# Altium schematic sheet Sheet1.SchDoc
size A4
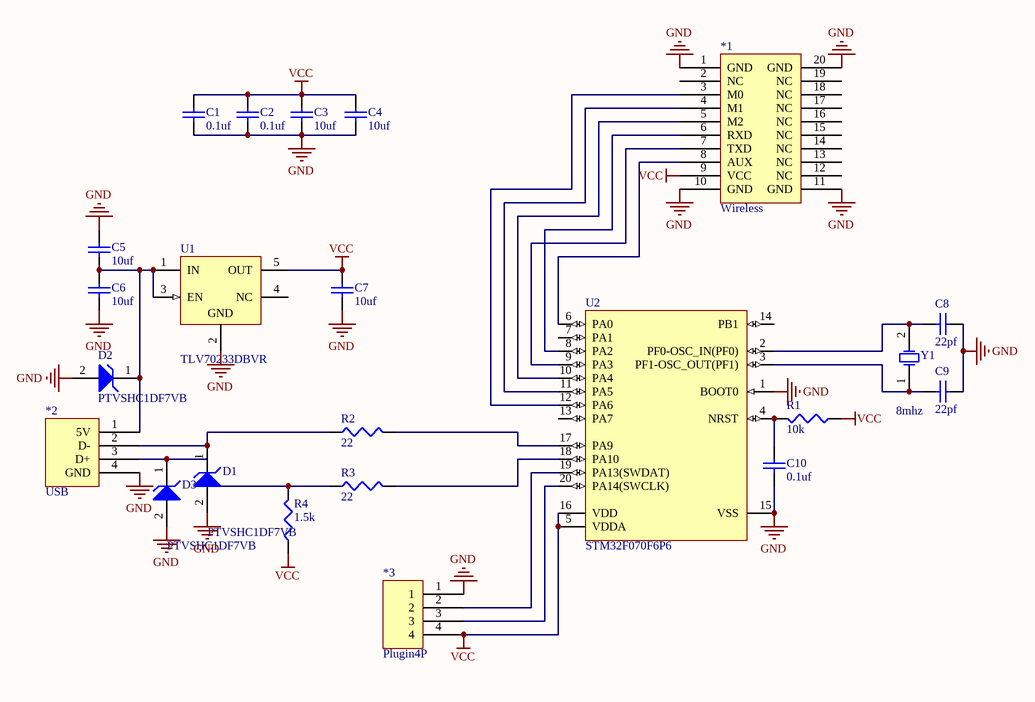
[diagram p0: Sheet1.SchDoc]

## Parts
*1  Wireless  [Wireless]
*2  USB  [DIP10]
*3  Plugin4P  [PLUGIN4P]
C1  0.1uf  [RESC2013X65X40LL15T20]
C2  0.1uf  [RESC2013X65X40LL15T20]
C3  10uf  [RESC2013X65X40LL15T20]
C4  10uf  [RESC2013X65X40LL15T20]
C5  10uf  [RESC2013X65X40LL15T20]
C6  10uf  [RESC2013X65X40LL15T20]
C7  10uf  [RESC2013X65X40LL15T20]
C8  22pf  [RESC2013X65X40LL15T20]
C9  22pf  [RESC2013X65X40LL15T20]
C10  0.1uf  [RESC2013X65X40LL15T20]
D1  PTVSHC1DF7VB  [ONSC-SOD-123-2-425-04_V]
D2  PTVSHC1DF7VB  [ONSC-SOD-123-2-425-04_V]
D3  PTVSHC1DF7VB  [ONSC-SOD-123-2-425-04_V]
R1  10k  [RESC2013X65X40LL15T20]
R2  22  [RESC2013X65X40LL15T20]
R3  22  [RESC2013X65X40LL15T20]
R4  1.5k  [RESC2013X65X40LL15T20]
U1  TLV70233DBVR  [TI-DBV5_N]
U2  STM32F070F6P6  [STM-TSSOP20_N]
Y1  8mhz  [XTAL]

## Nets
GND: *1.1(GND) *1.10(GND) *1.11(GND) *1.20(GND) *2.4(GND) *3.1 C1.1 C2.1 C3.1 C4.1 C5.2 C6.1 C7.1 C8.2 C9.2 C10.1 D1.2(A) D2.2(A) D3.2(A) U1.2(GND) U2.1(BOOT0) U2.15(VSS)
VCC: *1.9(VCC) *3.4 C1.2 C2.2 C3.2 C4.2 C7.2 R1.1 R4.1 U1.5(OUT) U2.5(VDDA) U2.16(VDD)
Net*1_3: *1.3(M0) U2.12(PA6)
Net*1_4: *1.4(M1) U2.11(PA5)
Net*1_5: *1.5(M2) U2.10(PA4)
Net*1_6: *1.6(RXD) U2.8(PA2)
Net*1_7: *1.7(TXD) U2.9(PA3)
Net*1_8: *1.8(AUX) U2.6(PA0)
Net*2_1: *2.1(5V) C5.1 C6.2 D2.1(K) U1.1(IN) U1.3(EN)
Net*2_2: *2.2(D-) D1.1(K) R2.1
Net*2_3: *2.3(D+) D3.1(K) R3.1 R4.2
Net*3_2: *3.2 U2.19(PA13(SWDAT))
Net*3_3: *3.3 U2.20(PA14(SWCLK))
NetC8_1: C8.1 U2.2(PF0-OSC_IN(PF0)) Y1.2(OSC2)
NetC9_1: C9.1 U2.3(PF1-OSC_OUT(PF1)) Y1.1(OSC1)
NetC10_2: C10.2 R1.2 U2.4(NRST)
NetR2_2: R2.2 U2.17(PA9)
NetR3_2: R3.2 U2.18(PA10)

Not connected (* = marked no-connect by the designer): *1 2(NC) 12(NC) 13(NC) 14(NC) 15(NC) 16(NC) 17(NC) 18(NC) 19(NC); U1 4(NC); U2 7(PA1) 13(PA7) 14(PB1)

## Library data of the parts
C1-C7 = Cap: Capacitor; Value: 100uf; Published: 8-Jun-2000; LatestRevisionDate: 17-Jul-2002; LatestRevisionNote: Re-released for DXP Platform.; PackageReference: RAD-0.3; Publisher: Altium Limited
C8-C10 = Cap: Capacitor; Published: 8-Jun-2000; LatestRevisionDate: 17-Jul-2002; LatestRevisionNote: Re-released for DXP Platform.; PackageReference: RAD-0.3; Publisher: Altium Limited
  C8 C9: Value: 22pF
  C10: Value: 0.1uf
D1-D3 = MMSZ39T1G: Zener Voltage Regulator, 500 mW, 2-Pin SOD-123, Pb-Free, Tape and Reel; Manufacturer: On Semiconductor; P Max (W): 0.5; DatasheetVersion: Rev. 11; PackageVersion: Rev. G, 10/2009; PackageReference: SOD-123-2-425-04; PackageDescription: 2-Pin SOD, Body 1.6 x 2.69 mm; Supplier 1: Digi-Key; Supplier Part Number 1: MMSZ39T1GOSTR-ND; Supplier 2: Digi-Key; Supplier Part Number 2: MMSZ39T1GOSCT-ND; Supplier 3: Digi-Key; Supplier Part Number 3: MMSZ39T1GOSDKR-ND; Supplier 4: Farnell; Supplier Part Number 4: 1887086; Supplier 5: Newark; Supplier Part Number 5: 09R9479; Supplier 6: Newark; Supplier Part Number 6: 26K4570; Supplier 7: Mouser; Supplier Part Number 7: 863-MMSZ39T1G; Packing: Tape and Reel; RoHS: Pb-Free; Mounting Technology: Surface Mount; PartNumber: MMSZ39T1G; ComponentLink1Description: Manufacturer URL; ComponentLink1URL: http://www.onsemi.com/; ComponentLink2Description: Datasheet; ComponentLink2URL: http://www.onsemi.com/pub_link/Collateral/MMSZ2V4T1-D.PDF; ComponentLink3Description: Package Specification; ComponentLink3URL: http://www.onsemi.com/pub_link/Collateral/425-04.PDF
R1-R4 = Res3: Resistor; Published: 8-Jun-2000; LatestRevisionDate: 29-May-2009; LatestRevisionNote: IPC-7351 Footprint Added.; PackageReference: J1-0603; Publisher: Altium Limited; PackageDescription: Chip Resistor
  R1: Value: 10K
  R2 R3: Value: 22
  R4: Value: 1.5K
U1 = TLV70233DBVR: Single Output LDO, 300 mA, Fixed 3.3 V Output, 2 to 5.5 V Input, with Low IQ, 5-pin SOT-23 (DBV), -40 to 125 degC, Green (RoHS & no Sb/Br); Manufacturer: Texas Instruments; Accuracy(%): 2; Fixed Output Options(V): 3.3; Iout(Max)(A): 0.3; Iq(Typ)(mA): 0.03; SubFamily: Single Channel LDO; Vdo(Typ)(mV): 220; Vin(Max)(V): 5.5; DatasheetVersion: SLVSAG6B; PackageVersion: 4073253-4/K; PackageReference: DBV5; PackageDescription: 5-Pin Plastic Small Outline, Body 1.60 脳 2.90 mm, Pitch 0.95 mm; Supplier 1: Digi-Key; Supplier Part Number 1: 296-32415-2-ND; Supplier 2: Digi-Key; Supplier Part Number 2: 296-32415-1-ND; Supplier 3: Digi-Key; Supplier Part Number 3: 296-32415-6-ND; Supplier 4: Newark; Supplier Part Number 4: 13T5909; Supplier 5: Mouser; Supplier Part Number 5: 595-TLV70233DBVR; Eco-Plan: Green (RoHS & no Sb/Br); Vin(Min)(V): 2; Vout Adj(Max)(V): 3.3; Vout Adj(Min)(V): 3.3; Mounting Technology: Surface Mount; Code_JEDEC: MO-178; PartNumber: TLV70233DBVR; ComponentLink1Description: Manufacturer URL; ComponentLink1URL: http://www.ti.com/; ComponentLink2Description: Datasheet; ComponentLink2URL: http://www.ti.com/general/docs/lit/getliterature.tsp?genericPartNumber=TLV70233&fileType=pdf; ComponentLink3Description: Package Specification; ComponentLink3URL: http://www.ti.com/litv/pdf/mpds018i
U2 = STM32F050F6P6: ARM Cortex-M0 32-bit MCU, 32 KB Flash, 4 KB Internal RAM, 15 I/Os, 20-pin TSSOP, -40 to 85 degC, Tube; FLASH Size (Prog) (kB): 32; I/Os (High Current): 15; Internal RAM Size (kB): 4; Operating Frequency(F) (Processor speed) (MHz): 48; Supply Voltage(Vcc) min (V): 2; DatasheetVersion: Rev. 1; PackageVersion: Rev. 1, 11/2012; PackageReference: TSSOP20; PackageDescription: 20-Pin Thin Shrink Small Outline Package, 6.5 x 4.4 mm Body, 0.65 mm Pitch; Supplier 1: Digi-Key; Supplier Part Number 1: STM32F050F6P6-ND; Supplier 2: Farnell; Supplier Part Number 2: 2333136; Supplier 3: Newark; Supplier Part Number 3: 99W9749; Supplier 4: Newark; Supplier Part Number 4: 89W1489; Supplier 5: Mouser; Supplier Part Number 5: 511-STM32F050F6P6; Core: ARM Cortex-M0; Packing: Tube; Mounting Technology: Surface Mount; PartNumber: STM32F050F6P6; ComponentLink1Description: Manufacturer URL; ComponentLink1URL: http://www.st.com/web/en/home.html; ComponentLink2Description: Datasheet; ComponentLink2URL: http://www.st.com/st-web-ui/static/active/en/resource/technical/document/datasheet/DM00065136.pdf; ComponentLink3Description: Package Specification; ComponentLink3URL: http://www.st.com/st-web-ui/static/active/en/resource/technical/document/datasheet/DM00065136.pdf
Y1 = XTAL: Crystal Oscillator; Published: 8-Jun-2000; LatestRevisionDate: 17-Jul-2002; LatestRevisionNote: Re-released for DXP Platform.; PackageReference: R38; Publisher: Altium Limited